# Altium schematic sheet SHEET1.SCHDOC
size A2
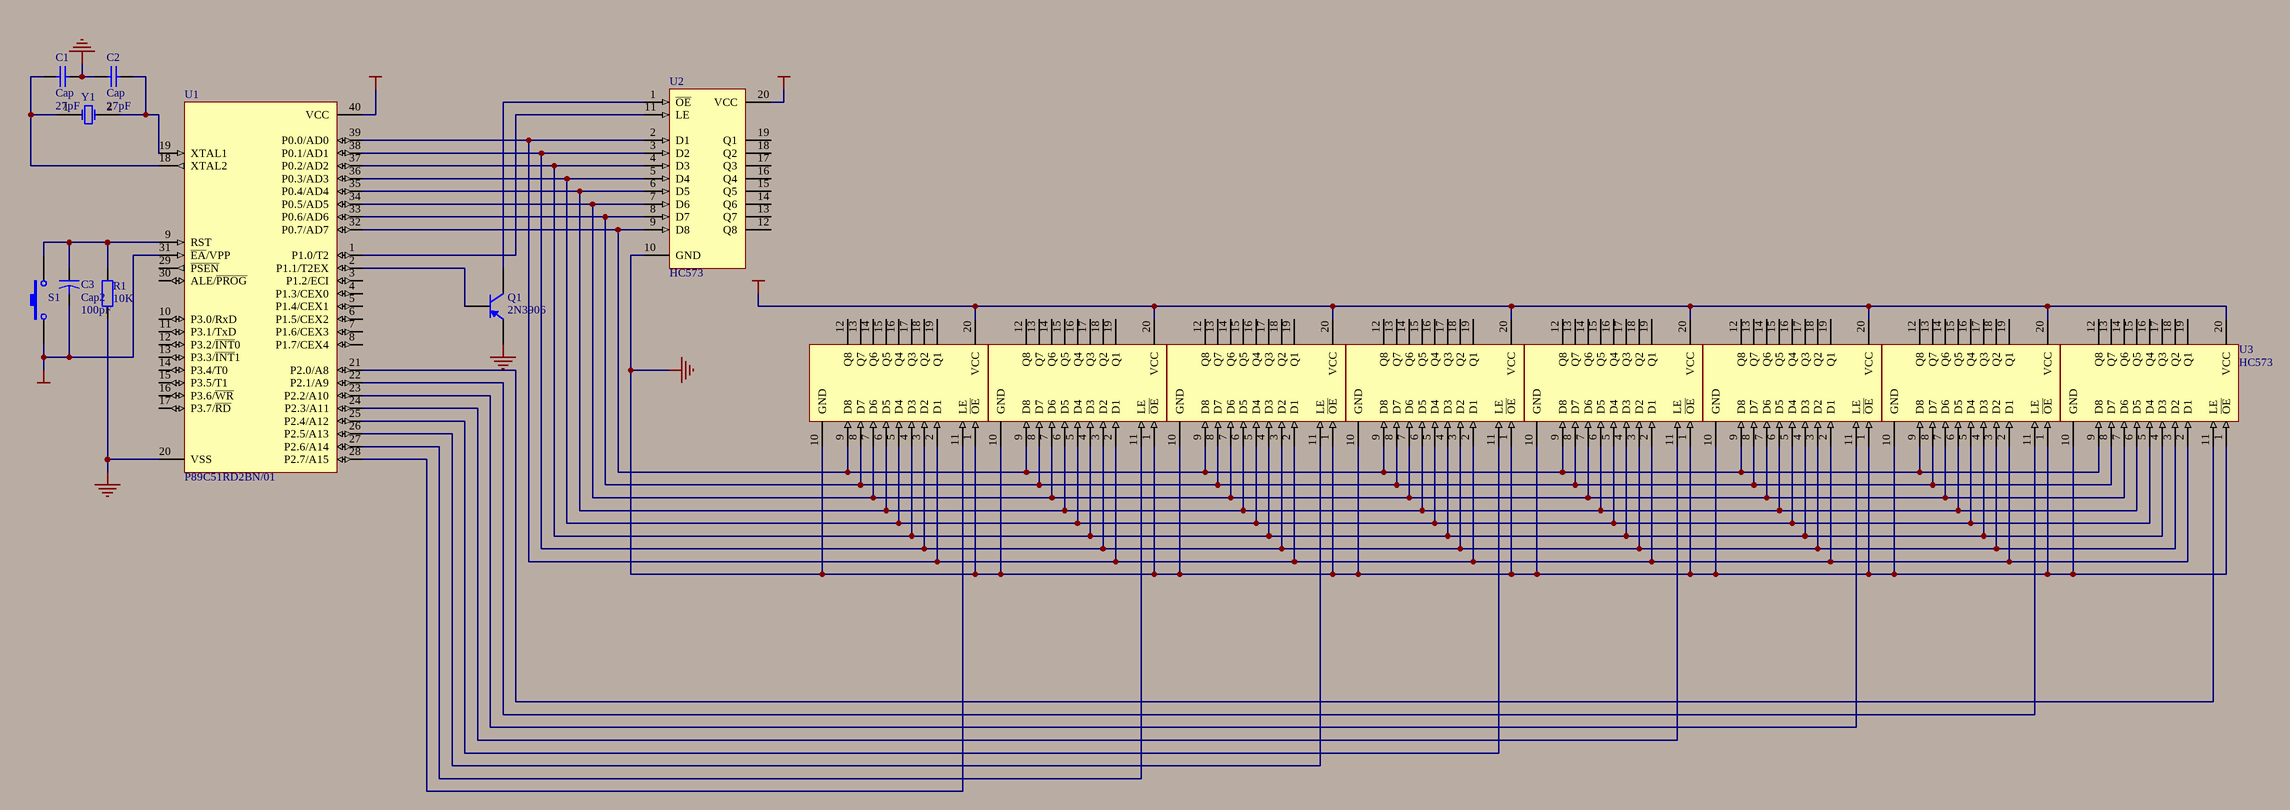
[diagram p0: SHEET1.SCHDOC]

## Parts
7  HC573  [CDIP20]
C1  Cap  value 27pF  [RAD-0.3]
C2  Cap  value 27pF  [RAD-0.3]
C3  Cap2  value 100pF  [CAPR5-4X5]
Q1  2N3906  [BCY-W3/E4]
R1  value 10K  [AXIAL-0.4]  (hidden comment: Res2)
S1  SW-PB  [SPST-2]  (value not drawn)
U1  P89C51RD2BN/01  [SOT129-1]
U2  HC573  [CDIP20]
U3  HC573  [CDIP20]
U4  HC573  [CDIP20]
U5  HC573  [CDIP20]
U6  HC573  [CDIP20]
U8  HC573  [CDIP20]
U9  HC573  [CDIP20]
U10  HC573  [CDIP20]
Y1  XTAL  [BCY-W2/D3.1]  (value not drawn)

## Nets
GND: 7.1(~{OE}) 7.10(GND) C1.2 C2.1 Q1.1(E) R1.1 U1.20(VSS) U2.10(GND) U3.1(~{OE}) U3.10(GND) U4.1(~{OE}) U4.10(GND) U5.1(~{OE}) U5.10(GND) U6.1(~{OE}) U6.10(GND) U8.1(~{OE}) U8.10(GND) U9.1(~{OE}) U9.10(GND) U10.1(~{OE}) U10.10(GND)
VCC: 7.20(VCC) C3.2 S1.1 U1.31(~{EA}/VPP) U1.40(VCC) U2.20(VCC) U3.20(VCC) U4.20(VCC) U5.20(VCC) U6.20(VCC) U8.20(VCC) U9.20(VCC) U10.20(VCC)
Net7_2: 7.2(D1) U1.39(P0.0/AD0) U2.2(D1) U3.2(D1) U4.2(D1) U5.2(D1) U6.2(D1) U8.2(D1) U9.2(D1) U10.2(D1)
Net7_3: 7.3(D2) U1.38(P0.1/AD1) U2.3(D2) U3.3(D2) U4.3(D2) U5.3(D2) U6.3(D2) U8.3(D2) U9.3(D2) U10.3(D2)
Net7_4: 7.4(D3) U1.37(P0.2/AD2) U2.4(D3) U3.4(D3) U4.4(D3) U5.4(D3) U6.4(D3) U8.4(D3) U9.4(D3) U10.4(D3)
Net7_5: 7.5(D4) U1.36(P0.3/AD3) U2.5(D4) U3.5(D4) U4.5(D4) U5.5(D4) U6.5(D4) U8.5(D4) U9.5(D4) U10.5(D4)
Net7_6: 7.6(D5) U1.35(P0.4/AD4) U2.6(D5) U3.6(D5) U4.6(D5) U5.6(D5) U6.6(D5) U8.6(D5) U9.6(D5) U10.6(D5)
Net7_7: 7.7(D6) U1.34(P0.5/AD5) U2.7(D6) U3.7(D6) U4.7(D6) U5.7(D6) U6.7(D6) U8.7(D6) U9.7(D6) U10.7(D6)
Net7_8: 7.8(D7) U1.33(P0.6/AD6) U2.8(D7) U3.8(D7) U4.8(D7) U5.8(D7) U6.8(D7) U8.8(D7) U9.8(D7) U10.8(D7)
Net7_9: 7.9(D8) U1.32(P0.7/AD7) U2.9(D8) U3.9(D8) U4.9(D8) U5.9(D8) U6.9(D8) U8.9(D8) U9.9(D8) U10.9(D8)
Net7_11: 7.11(LE) U1.25(P2.4/A12)
NetC1_1: C1.1 U1.18(XTAL2) Y1.1(OSC1)
NetC2_2: C2.2 U1.19(XTAL1) Y1.2(OSC2)
NetC3_1: C3.1 R1.2 S1.2 U1.9(RST)
NetQ1_2: Q1.2(B) U1.2(P1.1/T2EX)
NetQ1_3: Q1.3(C) U2.1(~{OE})
NetU1_1: U1.1(P1.0/T2) U2.11(LE)
NetU1_21: U1.21(P2.0/A8) U3.11(LE)
NetU1_22: U1.22(P2.1/A9) U4.11(LE)
NetU1_23: U1.23(P2.2/A10) U5.11(LE)
NetU1_24: U1.24(P2.3/A11) U6.11(LE)
NetU1_26: U1.26(P2.5/A13) U8.11(LE)
NetU1_27: U1.27(P2.6/A14) U9.11(LE)
NetU1_28: U1.28(P2.7/A15) U10.11(LE)

Not connected (* = marked no-connect by the designer): 7 12(Q8) 13(Q7) 14(Q6) 15(Q5) 16(Q4) 17(Q3) 18(Q2) 19(Q1); U1 3(P1.2/ECI) 4(P1.3/CEX0) 5(P1.4/CEX1) 6(P1.5/CEX2) 7(P1.6/CEX3) 8(P1.7/CEX4) 10(P3.0/RxD) 11(P3.1/TxD) 12(P3.2/~{INT}0) 13(P3.3/~{INT}1) 14(P3.4/T0) 15(P3.5/T1) 16(P3.6/~{WR}) 17(P3.7/~{RD}) 29(~{PSEN}) 30(ALE/~{PROG}); U2 12(Q8) 13(Q7) 14(Q6) 15(Q5) 16(Q4) 17(Q3) 18(Q2) 19(Q1); U3 12(Q8) 13(Q7) 14(Q6) 15(Q5) 16(Q4) 17(Q3) 18(Q2) 19(Q1); U4 12(Q8) 13(Q7) 14(Q6) 15(Q5) 16(Q4) 17(Q3) 18(Q2) 19(Q1); U5 12(Q8) 13(Q7) 14(Q6) 15(Q5) 16(Q4) 17(Q3) 18(Q2) 19(Q1); U6 12(Q8) 13(Q7) 14(Q6) 15(Q5) 16(Q4) 17(Q3) 18(Q2) 19(Q1); U8 12(Q8) 13(Q7) 14(Q6) 15(Q5) 16(Q4) 17(Q3) 18(Q2) 19(Q1); U9 12(Q8) 13(Q7) 14(Q6) 15(Q5) 16(Q4) 17(Q3) 18(Q2) 19(Q1); U10 12(Q8) 13(Q7) 14(Q6) 15(Q5) 16(Q4) 17(Q3) 18(Q2) 19(Q1)

## Library data of the parts
7 U2-U6 U8-U10 = M54HC573F1R: Octal D-Type Latch with 3-State Output Non-Inverting; Published: 8-Jun-2000; LatestRevisionDate: 17-Jul-2002; LatestRevisionNote: Re-released for DXP Platform.; DatasheetDocument: Oct-1993; PackageDocument: Sep-1994; PackageReference: CDIP20; Publisher: Altium Limited
C1 C2 = Cap: Capacitor; Published: 8-Jun-2000; LatestRevisionDate: 17-Jul-2002; LatestRevisionNote: Re-released for DXP Platform.; Publisher: Altium Limited
C3 = Cap2: Capacitor; Published: 23-Sep-2002; Publisher: Altium Limited
Q1 = 2N3906: PNP General Purpose Amplifier; Published: 8-Jun-2000; LatestRevisionDate: 15-Jan-2003; LatestRevisionNote: PCB Footprint 'BCY-W3/D4.7' replaced; DatasheetDocument: 1997; PackageReference: TO-92A; Publisher: Altium Limited; Code_JEDEC: TO-92A
R1 = Res2: Resistor; Published: 8-Jun-2000; LatestRevisionDate: 17-Jul-2002; LatestRevisionNote: Re-released for DXP Platform.; Publisher: Altium Limited
S1 = SW-PB: Switch; Published: 24-Mar-1999; LatestRevisionDate: 17-Jul-2002; LatestRevisionNote: Re-released for DXP Platform.; Publisher: Altium Limited
U1 = P89C51RD2BN/01: 80C51 8-Bit Flash Microcontroller Family, 64 kB ISP/IAP Flash with 1 kB RAM.; Published: 21-May-2003; DatasheetDocument: 18-Jul-2002; PackageDocument: 07-Aug-2000; PackageReference: SOT129-1; Publisher: Altium Limited; Code_JEDEC: MO-015
Y1 = XTAL: Crystal Oscillator; Published: 8-Jun-2000; LatestRevisionDate: 17-Jul-2002; LatestRevisionNote: Re-released for DXP Platform.; Publisher: Altium Limited